# Altium schematic sheet 1-wire adapter barebones.SchDoc
size A
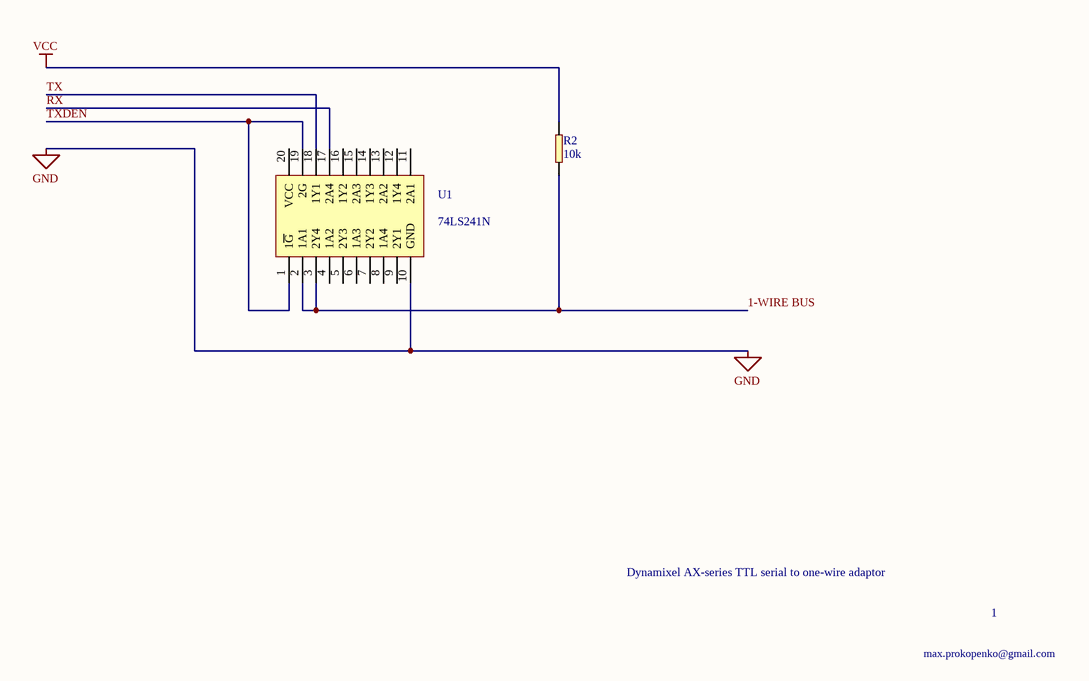
[diagram p0: 1-wire adapter barebones.SchDoc]

## Parts
R2  R: 10k  [0603]  (hidden comment: R 10k)
U1  74LS241N

## Nets
GND: U1.10(GND)
VCC: R2.1
1-WIRE BUS: R2.2 U1.2(1A1) U1.3(2Y4)
RX: U1.17(2A4)
TX: U1.18(1Y1)
TXDEN: U1.1(1~{G}) U1.19(2G)

Not connected (* = marked no-connect by the designer): U1 4(1A2) 5(2Y3) 6(1A3) 7(2Y2) 8(1A4) 9(2Y1) 11(2A1) 12(1Y4) 13(2A2) 14(1Y3) 15(2A3) 16(1Y2) 20(VCC)

## Notes on the sheet
- Dynamixel AX-series TTL serial to one-wire adaptor
- 1
- max.prokopenko@gmail.com

## Library data of the parts
R2 = R 10k: Supplier 1: Digi-Key; Supplier Part Number 1: 311-10KGRCT-ND